# EAGLE design control (EAGLE 9.6.2)
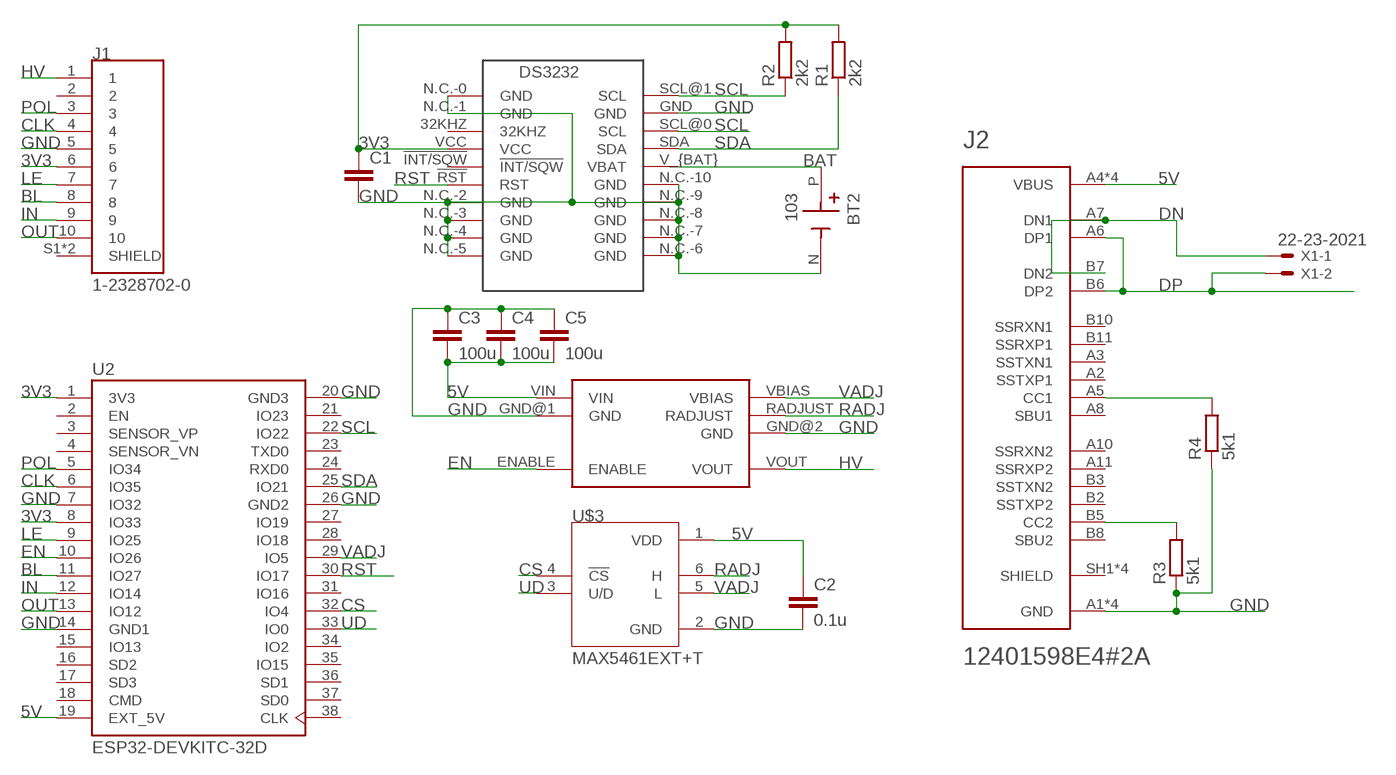
[diagram p0: schematic, sheet 1]

## Parts
BT2  103  [BAT_103]
C1  C-EUC0805  [C0805]
C2  0.1u  C-EUC0805  [C0805]
C3  100u  C-EUC1210  [C1210]
C4  100u  C-EUC1210  [C1210]
C5  100u  C-EUC1210  [C1210]
J1  1-2328702-0  [TE_1-2328702-0]
J2  12401598E4#2A  [AMPHENOL_12401598E4#2A]
R1  2k2  R-EU_R0805  [R0805]
R2  2k2  R-EU_R0805  [R0805]
R3  5k1  R-EU_R0805  [R0805]
R4  5k1  R-EU_R0805  [R0805]
U2  ESP32-DEVKITC-32D  [MODULE_ESP32-DEVKITC-32D]
U$1  DS3232  [SO20-2]
U$2  HV_PSU  [HV_PSU]
U$3  MAX5461EXT+T  [SOT65P210X110-6N]
X1  22-23-2021  [22-23-2021]

## Nets
3V3: C1.1 J1.6 R1.2 R2.2 U2.1(3V3) U2.8(IO33) U$1.VCC
5V: C2.1 C3.2 C4.2 C5.2 J2.A4(VBUS) J2.A9(VBUS) J2.B4(VBUS) J2.B9(VBUS) U2.19(EXT_5V) U$2.VIN U$3.1(VDD)
BAT: BT2.P(POS) U$1.V_{BAT}(VBAT)
BL: J1.8 U2.11(IO27)
CLK: J1.4 U2.6(IO35)
CS: U2.32(IO4) U$3.4(!CS)
DN: J2.A7(DN1) J2.B7(DN2) X1.1
DP: J2.A6(DP1) J2.B6(DP2) X1.2
EN: U2.10(IO26) U$2.ENABLE
GND: BT2.N(NEG) C1.2 C2.2 C3.1 C4.1 C5.1 J1.5 J2.A1(GND) J2.A12(GND) J2.B1(GND) J2.B12(GND) R3.1 R4.1 U2.7(IO32) U2.14(GND1) U2.20(GND3) U2.26(GND2) U$1.GND U$1.N.C.-0(GND) U$1.N.C.-1(GND) U$1.N.C.-2(GND) U$1.N.C.-3(GND) U$1.N.C.-4(GND) U$1.N.C.-5(GND) U$1.N.C.-6(GND) U$1.N.C.-7(GND) U$1.N.C.-8(GND) U$1.N.C.-9(GND) U$1.N.C.-10(GND) U$2.GND@1(GND) U$2.GND@2(GND) U$3.2(GND)
HV: J1.1 U$2.VOUT
IN: J1.9 U2.12(IO14)
LE: J1.7 U2.9(IO25)
N$1: J2.B5(CC2) R3.2
N$2: J2.A5(CC1) R4.2
OUT: J1.10 U2.13(IO12)
POL: J1.3 U2.5(IO34)
RADJ: U$2.RADJUST U$3.6(H)
RST: U2.30(IO17) U$1.!RST(RST)
SCL: R2.1 U2.22(IO22) U$1.SCL@0(SCL) U$1.SCL@1(SCL)
SDA: R1.1 U2.25(IO21) U$1.SDA
UD: U2.33(IO0) U$3.3(U/D)
VADJ: U2.29(IO5) U$2.VBIAS U$3.5(L)
Unconnected: J1.2 J1.S1(SHIELD) J1.S2(SHIELD) J2.A2(SSTXP1) J2.A3(SSTXN1) J2.A8(SBU1) J2.A10(SSRXN2) J2.A11(SSRXP2) J2.B2(SSTXP2) J2.B3(SSTXN2) J2.B8(SBU2) J2.B10(SSRXN1) J2.B11(SSRXP1) U2.2(EN) U2.3(SENSOR_VP) U2.4(SENSOR_VN) U2.15(IO13) U2.16(SD2) U2.17(SD3) U2.18(CMD) U2.21(IO23) U2.23(TXD0) U2.24(RXD0) U2.27(IO19) U2.28(IO18) U2.31(IO16) U2.34(IO2) U2.35(IO15) U2.36(SD1) U2.37(SD0) U2.38(CLK) U$1.32KHZ U$1.!INT/SQW

## Power pins joined to a net without a drawn wire
SHIELD: J2.SH1(SHIELD) J2.SH2(SHIELD) J2.SH3(SHIELD) J2.SH4(SHIELD)

## Library data of the parts
BT2 = 103:103: Check availability <https://pricing.snapeda.com/parts/103/Keystone/view-part?ref=eda>; AVAILABILITY: In Stock; CHECK_PRICES: https://www.snapeda.com/parts/103/Keystone/view-part/?ref=eda; DESCRIPTION: Battery Holder, Coin-Cell; 20 mm; 0.896in.; Glass Filled Nylon; 1; 1 AWG; MF: Keystone; MP: 103; PACKAGE: NON STANDARD-2 Keystone; PRICE: None; SNAPEDA_LINK: https://www.snapeda.com/parts/103/Keystone/view-part/?ref=snap
C1-C5 = rcl:C-EU: CAPACITOR, European symbol; SPICEPREFIX: C
J1 = 1-2328702-0:1-2328702-0: Receptacle Connector 10PIN 0.5MMP FPC CONN, BACK FLIP LOCK 10 POS Check availability <https://pricing.snapeda.com/parts/1-2328702-0/TE%20Connectivity/view-part?ref=eda>; AVAILABILITY: In Stock; CHECK_PRICES: https://www.snapeda.com/parts/1-2328702-0/TE+Connectivity+AMP+Connectors/view-part/?ref=eda; COMMENT: 1-2328702-0; DESCRIPTION: FPC Connector; 0.5mm pitch dual contact back flip FPC, 10pos | TE Connectivity 1-2328702-0; MF: TE Connectivity; MP: 1-2328702-0; PACKAGE: None; PRICE: None; PURCHASE-URL: https://www.snapeda.com/api/url_track_click_mouser/?unipart_id=3106381&manufacturer=TE Connectivity&part_name=1-2328702-0&search_term=1-2328702-0; SNAPEDA_LINK: https://www.snapeda.com/parts/1-2328702-0/TE+Connectivity+AMP+Connectors/view-part/?ref=snap
J2 = 12401598E4_2A:12401598E4#2A: USB-C (USB TYPE-C) USB 3.2 Gen 2 (USB 3.1 Gen 2, Superspeed + (USB 3.1)) Receptacle Connector 24 Position Surface Mount, Right Angle; Through Hole Check availability <https://pricing.snapeda.com/parts/12401598E4%232A/Amphenol%20ICC/view-part?ref=eda>; AVAILABILITY: In Stock; CHECK_PRICES: https://www.snapeda.com/parts/12401598E4%232A/Amphenol+FCI/view-part/?ref=eda; DESCRIPTION: USB3.2 GEN2, Type C, Top mount, CH 1.58mm, Dual Row SMT; MF: Amphenol ICC; MP: 12401598E4#2A; PACKAGE: None; PRICE: None; PURCHASE-URL: https://www.snapeda.com/api/url_track_click_mouser/?unipart_id=2762372&manufacturer=Amphenol ICC&part_name=12401598E4#2A&search_term=12401598e4; SNAPEDA_LINK: https://www.snapeda.com/parts/12401598E4%232A/Amphenol+FCI/view-part/?ref=snap
R1-R4 = rcl:R-EU_: RESISTOR, European symbol; SPICEPREFIX: R
U2 = SamacSys_Parts:ESP32-DEVKITC-32D: Eval Board For Esp-Wroom-32; AVAILABILITY: Unavailable; DESCRIPTION: - Transceiver; 802.11 b/g/n (Wi-Fi, WiFi, WLAN), Bluetooth® Smart Ready 4.x Dual Mode For Use With ESP-WROOM-32; MF: Espressif Systems; MP: ESP32-DEVKITC-32D; PACKAGE: None; PRICE: None
U$1 = ds3232:DS3232: Maxims DS3232 is a high precision rtc
U$2 = SamacSys_Parts:HV_PSU: HIGH VOLTAGE
U$3 = MAX5461EXT_T:MAX5461EXT+T: Check availability <https://pricing.snapeda.com/parts/MAX5461EXT%2BT/Analog%20Devices/view-part?ref=eda>; AVAILABILITY: In Stock; CHECK_PRICES: https://www.snapeda.com/parts/MAX5461EXT+T/Analog+Devices/view-part/?ref=eda; DESCRIPTION: Digital Potentiometer 100k Ohm 1 Circuit 32 Taps Up/Down (U/D, CS) Interface SC-70-6; MF: Analog Devices; MP: MAX5461EXT+T; PACKAGE: SC-70-6 Maxim; PRICE: None; PURCHASE-URL: https://www.snapeda.com/api/url_track_click_mouser/?unipart_id=1216321&manufacturer=Analog Devices&part_name=MAX5461EXT+T&search_term=max5461ext; SNAPEDA_LINK: https://www.snapeda.com/parts/MAX5461EXT+T/Analog+Devices/view-part/?ref=snap
X1 = con-molex:22-23-2021: .100" (2.54mm) Center Header - 2 Pin; MF: MOLEX; MPN: 22-23-2021; OC_FARNELL: 1462926; OC_NEWARK: 25C3832

## Board
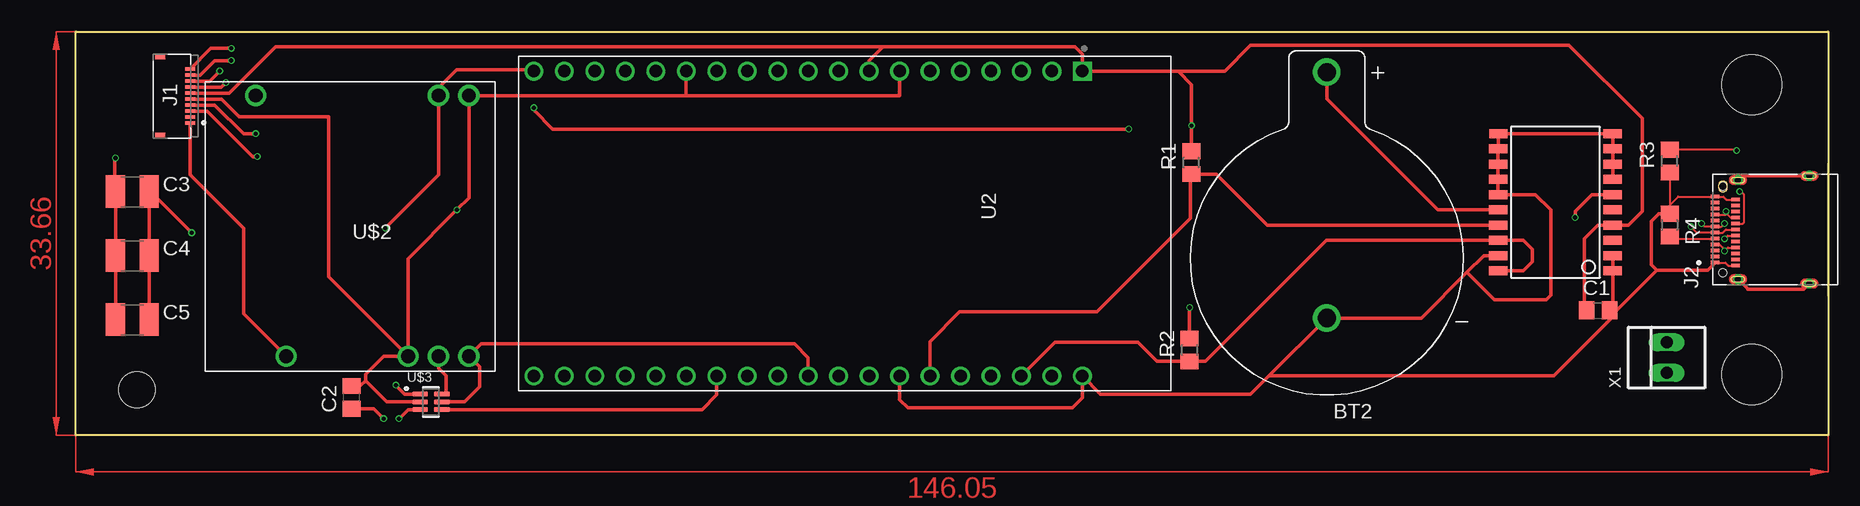
[diagram p1: board, top side]
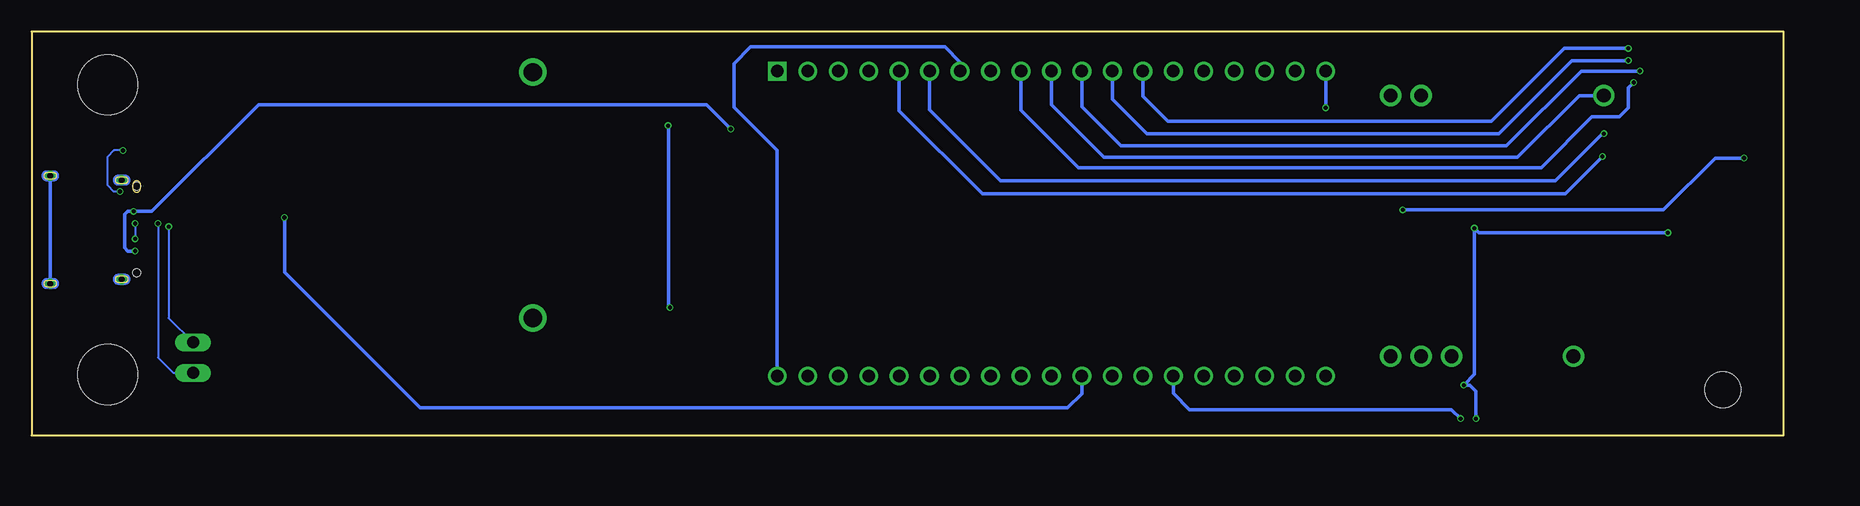
[diagram p2: board, bottom side, seen from below]

Size 146.05 x 33.66 mm. Coordinates in mm from the lower left corner, seen from the top.
Outline: 0,0 0,33.66 146.05,33.66 146.05,0 0,0
Copper layers (1*16): Top 0.035mm / dielectric 1.5mm / Bottom 0.035mm
Design rules "PCBWay_2L_100um-Track": minimum track width 0.1mm, minimum drill 0.3mm, track to track 0.1mm, track to pad 0.1mm, pad to pad 0.1mm, via to via 0.1mm, smd to smd 0mil, copper to edge 0.3mm, drill to drill 10mil, minimum pad ring 6mil, minimum via ring 0.1mm, stop-mask expansion 2mil, vias tented up to drill 0.45mm, thermal gap 0.2mm
Holes 5 mm at 139.7,29.21 139.7,5.08
Holes 3 mm at 5.08,3.81

### Footprints (pad centres in the part's own frame; a part is rotated, then mirrored left to right if it is on the bottom)
BAT_103 = drill 1.52: N 0,4.947; P 0,-15.543
C0805 = smd 1.3 x 1.5: 1 -0.95,0; 2 0.95,0
C1210 = smd 1.6 x 2.7: 1 -1.4,0; 2 1.4,0
TE_1-2328702-0 = smd 0.3 x 0.8: 1 0,0; 2 -0.5,0; 3 -1,0; 4 -1.5,0; 5 -2,0; 6 -2.5,0; 7 -3,0; 8 -3.5,0; 9 -4,0; 10 -4.5,0 | smd 0.4 x 0.8: S1 1,-2.5; S2 -5.5,-2.5
AMPHENOL_12401598E4#2A = smd 0.3 x 0.7: A1 -2.75,0.66; A2 -2.25,0.66; A3 -1.75,0.66; A4 -1.25,0.66; A5 -0.75,0.66; A6 -0.25,0.66; A7 0.25,0.66; A8 0.75,0.66; A9 1.25,0.66; A10 1.75,0.66; A11 2.25,0.66; A12 2.75,0.66; B1 2.5,-1.04; B2 2,-1.04; B3 1.5,-1.04; B4 1,-1.04; B5 0.5,-1.04; B6 0,-1.04; B7 -0.5,-1.04; B8 -1,-1.04; B9 -1.5,-1.04; B10 -2,-1.04; B11 -2.5,-1.04; B12 -3,-1.04 | drill 0.5 pad 0.8: SH1 -4.13,-1.25; SH2 -4.49,-7.2; SH3 4.49,-7.2; SH4 4.13,-1.25 | hole 0.65: -3.6,0; 3.6,0
R0805 = smd 1.3 x 1.5: 1 -0.95,0; 2 0.95,0
MODULE_ESP32-DEVKITC-32D = drill 1.04 square: 1 -12.7,19.76 | drill 1.04: 2 -12.7,17.22; 3 -12.7,14.68; 4 -12.7,12.14; 5 -12.7,9.6; 6 -12.7,7.06; 7 -12.7,4.52; 8 -12.7,1.98; 9 -12.7,-0.56; 10 -12.7,-3.1; 11 -12.7,-5.64; 12 -12.7,-8.18; 13 -12.7,-10.72; 14 -12.7,-13.26; 15 -12.7,-15.8; 16 -12.7,-18.34; 17 -12.7,-20.88; 18 -12.7,-23.42; 19 -12.7,-25.96; 20 12.7,19.76; 21 12.7,17.22; 22 12.7,14.68; 23 12.7,12.14; 24 12.7,9.6; 25 12.7,7.06; 26 12.7,4.52; 27 12.7,1.98; 28 12.7,-0.56; 29 12.7,-3.1; 30 12.7,-5.64; 31 12.7,-8.18; 32 12.7,-10.72; 33 12.7,-13.26; 34 12.7,-15.8; 35 12.7,-18.34; 36 12.7,-20.88; 37 12.7,-23.42; 38 12.7,-25.96
SO20-2 = smd 0.762 x 1.524: 32KHZ -3.175,-4.775; !INT/SQW -0.635,-4.775; !RST 0.635,-4.775; GND 0.635,4.775; N.C.-0 -5.715,-4.775; N.C.-1 -4.445,-4.775; N.C.-2 1.905,-4.775; N.C.-3 3.175,-4.775; N.C.-4 4.445,-4.775; N.C.-5 5.715,-4.775; N.C.-6 5.715,4.75; N.C.-7 4.445,4.775; N.C.-8 3.175,4.775; N.C.-9 1.905,4.775; N.C.-10 -4.445,4.775; SCL@0 -3.175,4.775; SCL@1 -5.715,4.775; SDA -1.905,4.775; V_{BAT} -0.635,4.775; VCC -1.905,-4.775
HV_PSU = drill 1.143 pad 1.778: ENABLE 19.939,1.143; GND@1 2.159,1.143; GND@2 7.239,22.86; RADJUST 4.699,22.86; VBIAS 2.159,22.86; VIN 4.699,1.143; VOUT 17.399,22.86
SOT65P210X110-6N = smd 1.3 x 0.4: 1 -0.905,0.65; 2 -0.905,0; 3 -0.905,-0.65; 4 0.91,-0.65; 5 0.91,0; 6 0.91,0.65
22-23-2021 = drill 1 long: 1 -1.27,0; 2 1.27,0

### Placement (x,y rotation side)
BT2  104.27,14.73 180 top
C1  126.87,10.41 0 top
C2  22.99,3.17 90 top
C3  4.7,20.32 0 top
C4  4.7,14.99 0 top
C5  4.7,9.65 0 top
J1  9.53,26.04 270 top
J2  137.29,17.14 90 top
R1  92.96,22.73 90 top
R2  92.84,7.11 90 top
R3  132.84,22.86 90 top
R4  132.84,17.53 270 top
U2  64.14,17.65 270 top
U$1  123.32,19.43 90 top
U$2  34.92,29.46 180 top
U$3  29.59,2.79 0 top
X1  132.59,6.48 90 top

### Tracks (layer width: path | path; a pad name or v marks a point on that pad's centre or on a via)
3V3  (via drill 0.35)
  Top 0.305: J1.6 12.79,28.54 16.64,32.38 67.26,32.38 | 67.26,32.38 66.11,31.24 U2.8 | 67.26,32.38 83.26,32.38 83.89,31.75 U2.1 91.88,30.35 | 91.88,30.35 95.76,30.35 97.92,32.51 124.46,32.51 130.56,26.42 130.56,18.67 129.41,17.53 U$1.VCC 126.87,17.53 125.73,16.38 125.73,10.61 C1.1 | R1.2 92.96,25.78 v93,25.81 93,29.24 91.88,30.35 | R2.2 92.84,10.54 92.96,10.67 v92.84,10.67
  Bottom 0.305: v92.84,10.67 92.96,10.79 92.96,25.78 v93,25.81
5V  (via drill 0.35)
  Top 0.152: J2.B4 137.94,18.14 137.54,18.54 v137.54,18.67 137.54,18.41 137.52,18.39 J2.A9 | J2.A4 137.01,15.89 137.41,15.49 v137.41,15.37 137.69,15.64 J2.B9
  Top 0.305: U2.19 38.05,30.48 31.75,30.48 30.23,28.96 U$2.VIN 30.23,21.72 v25.78,17.27 | U$3.1 27.42,3.44 v26.67,4.19 | C2.1 24.83,2.23 v25.65,1.4 | C3.2 6.1,20.07 | 6.1,20.07 C4.2 | C4.2 C5.2 | C4.2 6.1,19.81 6.73,19.81 v9.65,16.89 | 6.22,20.19 6.1,20.07 | v87.76,25.53 39.75,25.53 38.17,27.1 v38.17,27.3
  Bottom 0.305: v25.65,1.4 25.65,3.68 26.16,4.19 v26.67,4.19 25.78,5.08 v25.78,17.27 25.4,16.89 v9.65,16.89 | v137.41,15.37 138.05,15.37 138.3,15.62 138.3,18.41 138.05,18.67 v137.54,18.67 136.02,18.67 127.13,27.56 89.79,27.56 v87.76,25.53 | U2.19 v38.17,27.3
BAT
  Top 0.305: U$1.V_{BAT} 113.54,18.8 104.27,28.07 BT2.P
BL  (via drill 0.35)
  Top 0.305: J1.8 11.15,29.54 v11.98,30.36
  Bottom 0.305: v11.98,30.36 16.88,30.36 23.11,24.13 55.24,24.13 58.49,27.38 U2.11
CLK  (via drill 0.35)
  Top 0.305: J1.4 11.58,27.54 13.97,25.15 v14.99,25.15
  Bottom 0.305: v14.99,25.15 15.11,25.15 19.02,21.23 65.28,21.23 71.19,27.15 U2.6
CS
  Top 0.305: U2.32 53.41,3.38 52.18,2.14 U$3.4
DN  (via drill 0.35)
  Top 0.152: v137.41,17.65 137.16,17.39 J2.A7 135.77,17.39 v135.51,17.65 | v137.41,16.38 137.68,16.64 J2.B7
  Bottom 0.152: v137.41,17.65 v137.41,16.38 | v135.51,17.65 135.51,6.48 134.24,5.21 X1.1
DP  (via drill 0.35)
  Top 0.152: J2.B6 137.54,17.14 137.29,16.89 137.28,16.89 J2.A6 135.12,16.89 v134.62,17.4
  Bottom 0.152: v134.62,17.4 134.62,9.78 X1.2
EN
  Bottom 0.305: U$2.ENABLE 17.03,28.32 22.19,23.16 56.64,23.16 61.03,27.56 U2.10
GND  (via drill 0.35)
  Top 0.152: J2.B1 137.58,19.64 137.33,19.89 J2.A12 133.56,19.89 132.84,19.18 R4.1 R3.1 | J2.A1 136.65,14.39 137.5,14.39 137.75,14.14 J2.B12
  Top 0.305: 50.88,28.32 U$2.GND@1 32.77,19.81 v31.75,18.8 27.69,14.73 U$2.GND@2 | J1.5 12.13,28.04 13.62,26.54 21.08,26.54 21.08,13.21 U$2.GND@2 | U2.14 50.88,28.32 | U2.7 68.66,28.32 50.88,28.32 | U$1.N.C.-10 117.35,14.99 115.95,13.59 | 115.95,13.59 112.15,9.79 BT2.N 99.44,4.95 | U$1.N.C.-1 U$1.N.C.-0 128.09,10.68 C1.2 | U$1.N.C.-2 U$1.N.C.-3 U$1.N.C.-4 U$1.N.C.-5 U$1.N.C.-6 118.57,23.9 U$1.N.C.-7 U$1.N.C.-8 U$1.N.C.-9 U$1.GND 121.67,20.07 122.94,18.8 122.94,11.68 122.56,11.3 118.24,11.3 115.95,13.59 | 99.44,4.95 97.91,3.43 85.42,3.43 U2.20 83.89,3.12 83.06,2.29 69.34,2.29 68.66,2.97 U2.26 | 99.44,4.95 123.2,4.95 127.95,9.71 127.95,10.29 C1.2 | 24.13,4.57 24.13,5.08 25.65,6.6 U$2.GND@2 | 24.13,4.57 25.91,2.79 U$3.2 | 24.13,4.57 23.68,4.12 C2.2 | C5.1 C4.1 C3.1 3.17,20.32 3.24,20.38 3.24,23.05 v3.3,23.11 | R4.1 131.95,18.48 131.32,17.84 131.32,14.22 131.78,13.76 | 131.78,13.76 128.44,10.41 C1.2 | 136.65,14.39 136.02,13.76 131.78,13.76
  Bottom 0.305: U2.7 68.66,31.11 69.92,32.38 86.11,32.38 87.5,30.99 87.5,27.36 83.89,23.75 U2.20 | v31.75,18.8 10.03,18.8 5.71,23.11 v3.3,23.11
HV
  Top 0.305: J1.1 9.53,21.72 13.97,17.27 13.97,10.16 U$2.VOUT
IN  (via drill 0.35)
  Top 0.305: J1.9 10.35,30.04 11.56,31.24 v12.95,31.24
  Bottom 0.305: v12.95,31.24 17.65,31.24 23.75,25.15 53.09,25.15 55.95,28.02 U2.12
LE  (via drill 0.35)
  Top 0.305: J1.7 12.13,29.04 v12.5,29.41
  Bottom 0.305: v12.5,29.41 12.95,28.96 12.95,27.3 13.72,26.54 16,26.54 20.22,22.33 58.8,22.33 63.58,27.1 U2.9
N$1  (via drill 0.35)
  Top 0.152: v138.43,23.75 138.37,23.81 R3.2 | J2.B5 138.94,17.64 139.06,17.77 139.06,20.07 138.81,20.32 v138.68,20.32
  Bottom 0.152: v138.68,20.32 139.19,20.32 139.7,20.83 139.7,23.24 139.19,23.75 v138.43,23.75
N$2
  Top 0.152: J2.A5 132.84,16.39 R4.2
OUT  (via drill 0.35)
  Top 0.305: v12.95,32.26 11.25,32.26 J1.10
  Bottom 0.305: v12.95,32.26 18.29,32.26 24.38,26.16 51.31,26.16 53.41,28.27 U2.13
POL  (via drill 0.35)
  Top 0.305: J1.3 10.94,27.04 14.73,23.24 v15.11,23.24
  Bottom 0.305: v15.11,23.24 18.21,20.14 66.8,20.14 73.73,27.07 U2.5
RADJ
  Top 0.305: U$2.RADJUST 30.23,5.59 30.86,4.95 30.86,3.56 30.75,3.44 U$3.6
RST  (via drill 0.35)
  Top 0.305: U$1.!RST 126.36,20.07 124.97,18.67 v124.97,18.16
  Bottom 0.305: U2.30 58.49,3.48 59.69,2.29 113.67,2.29 124.97,13.59 v124.97,18.16
SCL
  Top 0.305: U2.22 81.61,7.75 88.52,7.75 90.1,6.16 R2.1 94.16,6.16 104.25,16.26 U$1.SCL@0 120.65,16.26 121.41,15.49 121.41,14.48 120.65,13.72 U$1.SCL@1
SDA
  Top 0.305: U2.25 71.19,7.82 73.66,10.29 85.09,10.29 92.9,18.1 92.9,21.34 92.96,21.4 R1.1 95.06,21.78 99.31,17.53 U$1.SDA
SHIELD
  Top 0.152: 139.34,12.21 139.36,12.19
  Top 0.305: J2.SH4 138.9,21.64 J2.SH3 | J2.SH1 139.34,12.21 | 139.36,12.19 144.02,12.19 J2.SH2
  Bottom 0.305: J2.SH3 J2.SH2
UD  (via drill 0.35)
  Top 0.305: U$3.3 27.67,2.14 v26.92,1.4
  Bottom 0.305: v26.92,1.4 27.69,2.16 49.53,2.16 50.88,3.5 U2.33
VADJ
  Top 0.305: U2.29 61.03,6.48 59.89,7.62 33.78,7.62 U$2.VBIAS 33.66,5.71 33.66,4.06 32.38,2.79 31.62,2.79 U$3.5
(copper drawn outside any net)
  shapes: Top area x2